# EAGLE schematic licznik (EAGLE 7.5.0)
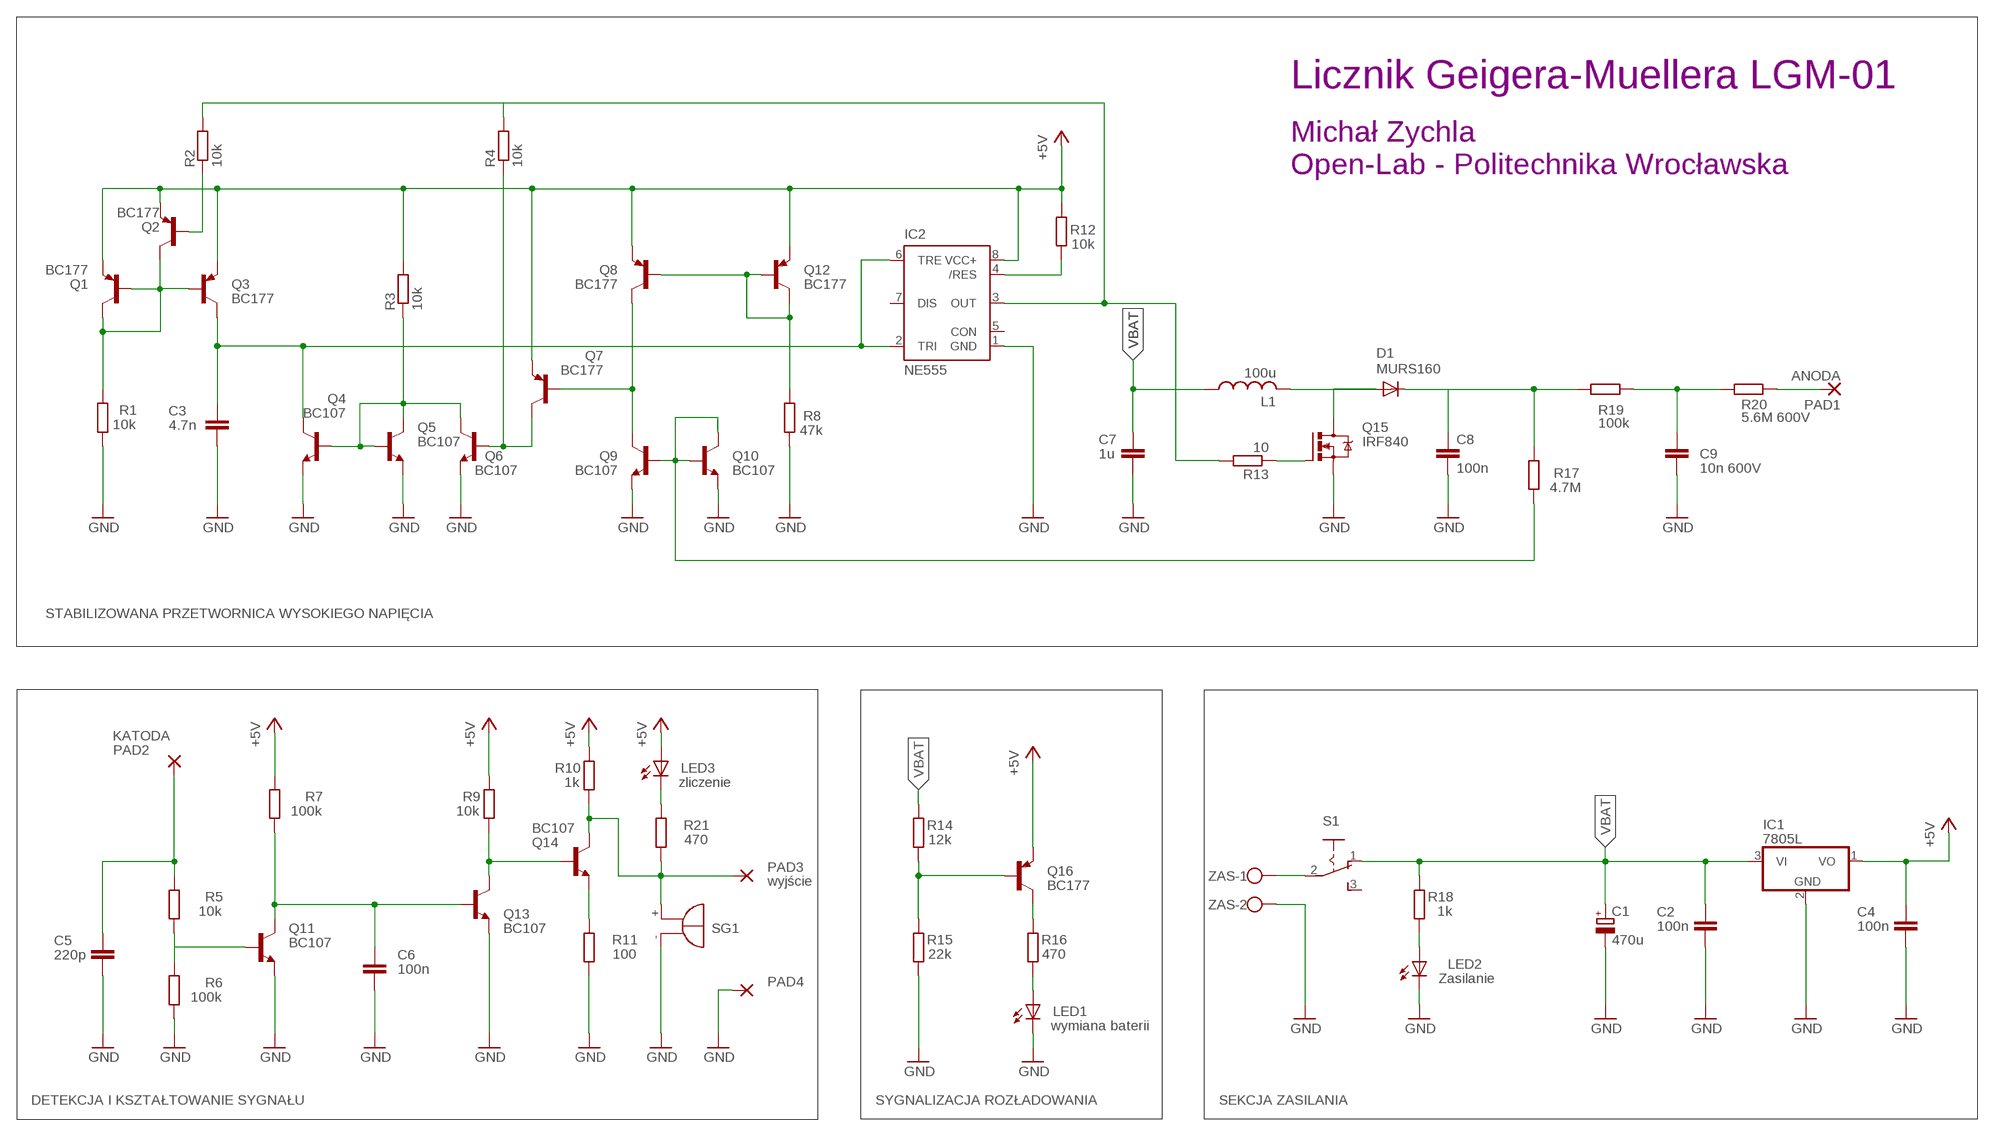
[diagram p0: schematic, sheet 1]

## Parts
C1  470u  CPOL-EUE3.5-8  [E3,5-8]
C2  100n  C5/3  [C5B3]
C3  4.7n  C5/3  [C5B3]
C4  100n  C5/3  [C5B3]
C5  220p  C5/3  [C5B3]
C6  100n  C5/3  [C5B3]
C7  1u  C5/3  [C5B3]
C8  100n  C-EU075-032X103  [C075-032X103]
C9  10n 600V  C5/3  [C5B3]
D1  MURS160  DIODE-SMB  [SMB]
IC1  7805L  [TO92]
IC2  NE555  [DIL-08]
L1  100u  L-USTJ3-U1  [TJ3-U1]
LED1  wymiana baterii  LED3MM  [LED3MM]
LED2  Zasilanie  LED3MM  [LED3MM]
LED3  zliczenie  LED3MM  [LED3MM]
PAD1  ANODA  WIREPAD2,15/1,0  [2,15/1,0]
PAD2  KATODA  WIREPAD2,15/1,0  [2,15/1,0]
PAD3  wyjście  WIREPAD2,15/1,0  [2,15/1,0]
PAD4  WIREPAD2,15/1,0  [2,15/1,0]
Q1  BC177  [TO18]
Q2  BC177  [TO18]
Q3  BC177  [TO18]
Q4  BC107  [TO18]
Q5  BC107  [TO18]
Q6  BC107  [TO18]
Q7  BC177  [TO18]
Q8  BC177  [TO18]
Q9  BC107  [TO18]
Q10  BC107  [TO18]
Q11  BC107  [TO18]
Q12  BC177  [TO18]
Q13  BC107  [TO18]
Q14  BC107  [TO18]
Q15  IRF840  IRF740  [TO220BV]
Q16  BC177  [TO18]
R1  10k  R-EU_0207/10  [0207/10]
R2  10k  R-EU_0207/10  [0207/10]
R3  10k  R-EU_0207/10  [0207/10]
R4  10k  R-EU_0207/10  [0207/10]
R5  10k  R-EU_0207/10  [0207/10]
R6  100k  R-EU_0207/10  [0207/10]
R7  100k  R-EU_0207/10  [0207/10]
R8  47k  R-EU_0207/10  [0207/10]
R9  10k  R-EU_0207/10  [0207/10]
R10  1k  R-EU_0207/10  [0207/10]
R11  100  R-EU_0207/10  [0207/10]
R12  10k  R-EU_0207/10  [0207/10]
R13  10  R-EU_0207/10  [0207/10]
R14  12k  R-EU_0207/10  [0207/10]
R15  22k  R-EU_0207/10  [0207/10]
R16  470  R-EU_0207/10  [0207/10]
R17  4.7M  R-EU_0207/10  [0207/10]
R18  1k  R-EU_0207/10  [0207/10]
R19  100k  R-EU_0207/10  [0207/10]
R20  5.6M 600V  R-EU_0411/12  [0411/12]
R21  470  R-EU_0207/10  [0207/10]
S1  255SB  [255SB]
SG1  F/QMBIII  [F/QMBIII]
ZAS  W237-102  [W237-102]

## Nets
+5V: C4.1 IC1.1(VO) IC2.8(VCC+) LED3.A Q1.1(E) Q2.1(E) Q3.1(E) Q7.1(E) Q8.1(E) Q12.1(E) Q16.1(E) R3.2 R7.2 R9.2 R10.2 R12.2
GND: C1.- C2.2 C3.2 C4.2 C5.2 C6.2 C7.2 C8.2 C9.2 IC1.2(GND) IC2.1(GND) LED1.K(C) LED2.K(C) PAD4.1(P) Q4.1(E) Q5.1(E) Q6.1(E) Q9.1(E) Q10.1(E) Q11.1(E) Q13.1(E) Q15.S R1.1 R6.1 R8.1 R11.1 R15.1 SG1.-(+) ZAS.2
KATODA: C5.1 PAD2.1(P) R5.2
N$1: C8.1 D1.C R17.2 R19.2
N$2: Q6.2(B) Q7.3(C) R4.1
N$3: IC2.3(OUT) R2.2 R4.2 R13.2
N$4: Q1.2(B) Q1.3(C) Q2.3(C) Q3.2(B) R1.2
N$5: C3.1 IC2.2(TRI) IC2.6(TRE) Q3.3(C) Q4.3(C)
N$6: D1.A L1.2 Q15.D
N$7: Q4.2(B) Q5.2(B) Q5.3(C) Q6.3(C) R3.1
N$8: Q2.2(B) R2.1
N$9: Q15.G R13.1
N$10: C9.1 R19.1 R20.1
N$11: Q8.2(B) Q12.2(B) Q12.3(C) R8.2
N$12: Q9.2(B) Q10.2(B) Q10.3(C) R17.1
N$13: Q7.2(B) Q8.3(C) Q9.3(C)
N$14: LED2.A R18.1
N$15: LED1.A R16.1
N$16: IC2.4(/RES) R12.1
N$17: Q11.2(B) R5.1 R6.2
N$18: C6.1 Q11.3(C) Q13.2(B) R7.1
N$19: Q14.1(E) R11.2
N$20: S1.2(P) ZAS.1
N$21: Q13.3(C) Q14.2(B) R9.1
N$22: Q16.3(C) R16.2
N$23: Q16.2(B) R14.1 R15.2
N$24: LED3.K(C) R21.2
N$25: PAD1.1(P) R20.2
VBAT: C1.+ C2.1 C7.1 IC1.3(VI) L1.1 R14.2 R18.2 S1.1(O)
WYJSCIE: PAD3.1(P) Q14.3(C) R10.1 R21.1 SG1.+(-)
Unconnected: IC2.5(CON) IC2.7(DIS) S1.3(S)

## Notes on the sheet
- Licznik Geigera-Muellera LGM-01
- Michał Zychla
  Open-Lab - Politechnika Wrocławska
- STABILIZOWANA PRZETWORNICA WYSOKIEGO NAPIĘCIA
- DETEKCJA I KSZTAŁTOWANIE SYGNAŁU | SYGNALIZACJA ROZŁADOWANIA | SEKCJA ZASILANIA

## Library data of the parts
C1 = resistor:CPOL-EU: POLARIZED CAPACITOR, European symbol
C2-C7 C9 = capacitor-wima:C: CAPACITOR naming: grid - package width
C8 = rcl:C-EU: CAPACITOR, European symbol
D1 = diode:DIODE-: DIODE
IC1 = linear:78*: Positive VOLTAGE REGULATOR Source: http://cache.national.com/ds/LM/LM78L05.pdf http://www.fairchildsemi.com/ds/LM/LM7805.pdf
IC2 = st-microelectronics:NE555: General purpose bipolar Timer; MF: Arrow Electronics; MPN: NE555N; OC_FARNELL: 1467742; OC_NEWARK: 89K1486
L1 = rcl:L-US: INDUCTOR, American symbol
LED1-LED3 = led:LED: LED OSRAM: - CHIPLED LG R971, LG N971, LY N971, LG Q971, LY Q971, LO R971, LY R971 LH N974, LH R974 LS Q976, LO Q976, LY Q976 LO Q996 - Hyper CHIPLED LW Q18S LB Q993, LB Q99A, LB R99A - SideLED LS A670, LO A670, LY A670, LG A670, LP A670 LB A673, LV A673, LT A673, LW A673 LH A674 LY A675 LS A676, LA A676, LO A676, LY A676, LW A676 LS A679, LY A679, LG A679 - Hyper Micro SIDELED® LS Y876, LA Y876, LO Y876, LY Y876 LT Y87S - SmartLED LW L88C, LW L88S LB L89C, LB L89S, LG L890 LS L89K, LO L89K, LY L89K LS L896, LA L896, LO L896, LY L896 - TOPLED LS T670, LO T670, LY T670, LG T670, LP T670 LSG T670, LSP T670, LSY T670, LOP T670, LYG T670 LG T671, LOG T671, LSG T671 LB T673, LV T673, LT T673, LW T673 LH T674 LS T676, LA T676, LO T676, LY T676, LB T676, LH T676, LSB T676, LW T676 LB T67C, LV T67C, LT T67C, LS T67K, LO T67K, LY T67K, LW E67C LS E67B, LA E67B, LO E67B, LY E67B, LB E67C, LV E67C, LT E67C LW T67C LS T679, LY T679, LG T679 LS T770, LO T770, LY T770, LG T770, LP T770 LB T773, LV T773, LT T773, LW T773 LH T774 LS E675, LA E675, LY E675, LS T675 LS T776, LA T776, LO T776, LY T776, LB T776 LHGB T686 LT T68C, LB T68C - Hyper Mini TOPLED® LB M676 - Mini TOPLED Santana® LG M470 LS M47K, LO M47K, LY M47K Source: http://www.osram.convergy.de LUXEON: - LUMILED® LXK2-PW12-R00, LXK2-PW12-S00, LXK2-PW14-U00, LXK2-PW14-V00 LXK2-PM12-R00, LXK2-PM12-S00, LXK2-PM14-U00 LXK2-PE12-Q00, LXK2-PE12-R00, LXK2-PE12-S00, LXK2-PE14-T00, LXK2-PE14-U00 LXK2-PB12-K00, LXK2-PB12-L00, LXK2-PB12-M00, LXK2-PB14-N00, LXK2-PB14-P00, LXK2-PB14-Q00 LXK2-PR12-L00, LXK2-PR12-M00, LXK2-PR14-Q00, LXK2-PR14-R00 LXK2-PD12-Q00, LXK2-PD12-R00, LXK2-PD12-S00 LXK2-PH12-R00, LXK2-PH12-S00 LXK2-PL12-P00, LXK2-PL12-Q00, LXK2-PL12-R00 Source: www.luxeon.com KINGBRIGHT: KA-3528ASYC Source: www.kingbright.com
PAD1-PAD4 = wirepad:WIREPAD: Wire PAD connect wire on PCB
Q1-Q3 Q7 Q8 Q12 Q16 = transistor-pnp:BC177*: PNP Transistor
Q4-Q6 Q9-Q11 Q13 Q14 = transistor-npn:BC107: NPN Transistor
Q15 = transistor-power:IRF740: N-CHANNEL MOS FET
R1-R21 = resistor:R-EU_: RESISTOR, European symbol
S1 = switch:255SB: SLIDING SWITCH Distributor Buerklin, 11G810
SG1 = buzzer:F/QMBIII: BUZZER Source: Buerklin; OC_FARNELL: unknown; OC_NEWARK: unknown
ZAS = con-wago-500:W237-102: WAGO SCREW CLAMP; MPN: 237-102; OC_FARNELL: unknown; OC_NEWARK: 70K9898